# Altium schematic sheet peripherals.SchDoc
size A3; DocumentNumber: 28; SheetNumber: 28; SheetTotal: 45; SheetDescription: MCU Peripherals
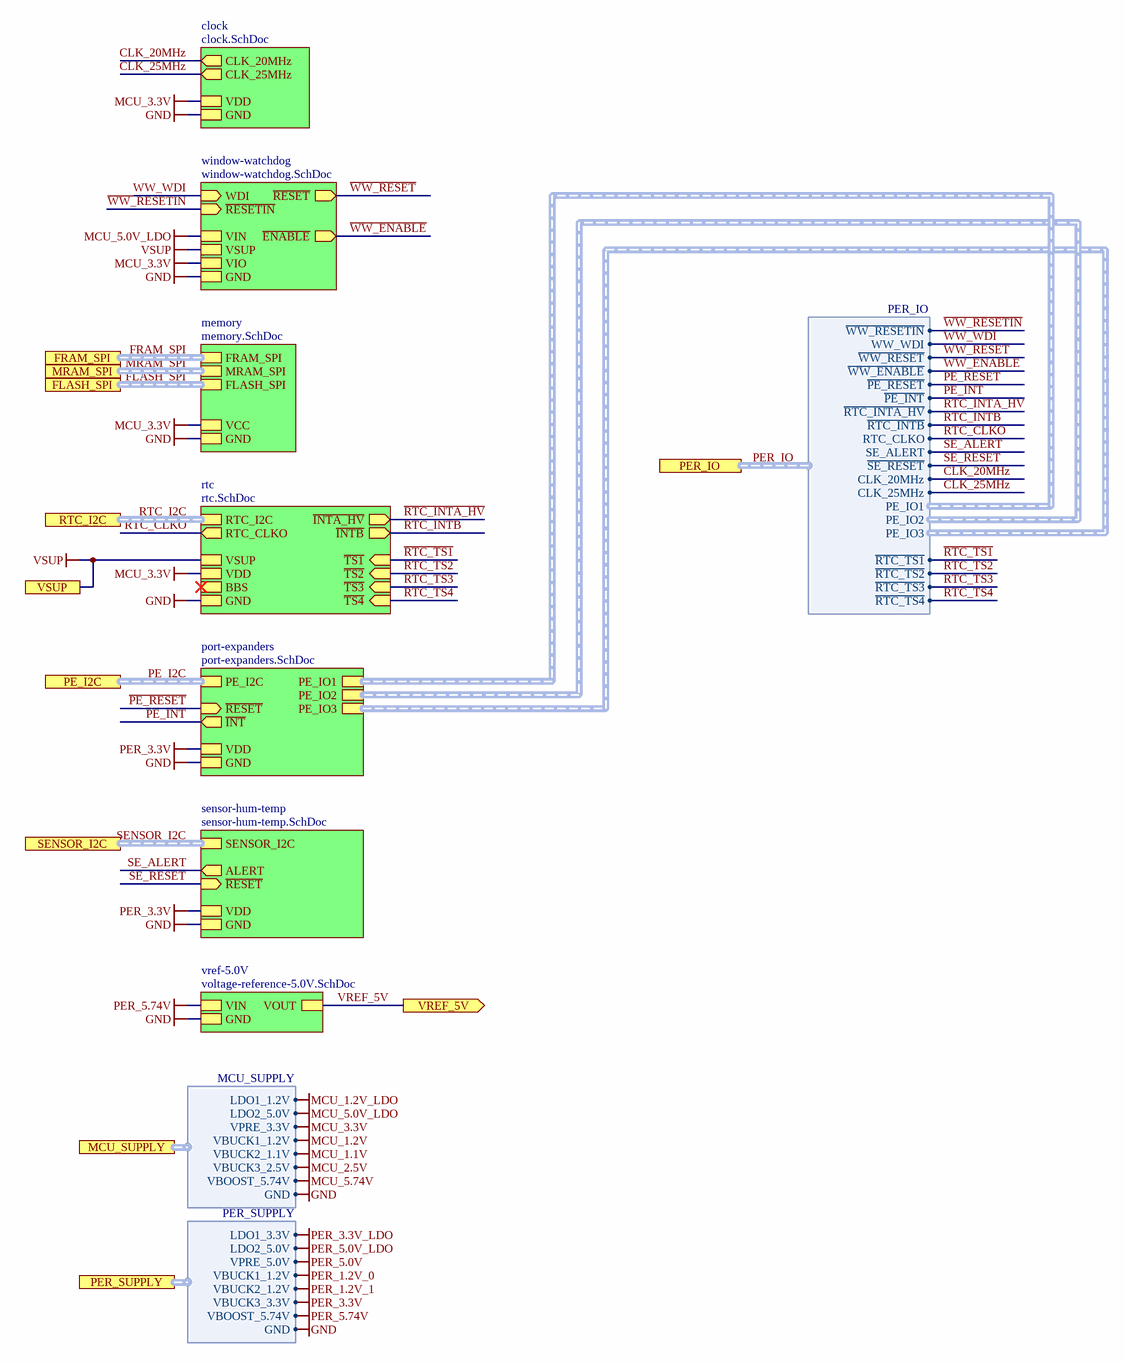
[diagram p0: peripherals.SchDoc]

## Sub-sheets
clock = clock.SchDoc: VDD, GND, CLK_20MHz (out), CLK_25MHz (out)
memory = memory.SchDoc: VCC, GND, FRAM_SPI (harness SPI), MRAM_SPI (harness SPI), FLASH_SPI (harness SPI)
port-expanders = port-expanders.SchDoc: PE_IO2 (harness PE_IO), PE_IO1 (harness PE_IO), GND, VDD, ~{RESET} (in), PE_I2C (harness I2C), ~{INT} (out), PE_IO3 (harness PE_IO)
rtc = rtc.SchDoc: RTC_I2C (harness I2C), ~{INTB} (out), ~{INTA_HV} (out), GND, VSUP, ~{TS4} (in), ~{TS3} (in), ~{TS2} (in), ~{TS1} (in), BBS, RTC_CLKO (out), VDD
sensor-hum-temp = sensor-hum-temp.SchDoc: GND, ~{RESET} (in), ALERT (out), VDD, SENSOR_I2C (harness I2C)
vref-5.0V = voltage-reference-5.0V.SchDoc: GND, VOUT, VIN
window-watchdog = window-watchdog.SchDoc: GND, VIO, ~{ENABLE} (out), ~{RESET} (out), WDI (in), VIN, ~{RESETIN} (in), VSUP

## Ports
FLASH_SPI (harness SPI), FRAM_SPI (harness SPI), MCU_SUPPLY (harness MCU_SUPPLY), MRAM_SPI (harness SPI), PE_I2C (harness I2C), PER_IO (harness PER_IO), PER_SUPPLY (harness PER_SUPPLY), RTC_I2C (harness I2C), SENSOR_I2C (harness I2C), VREF_5V (out), VSUP

## Harnesses
MCU_SUPPLY: VBUCK1_1.2V, VBUCK2_1.1V, VBUCK3_2.5V, LDO1_1.2V, LDO2_5.0V, GND, VPRE_3.3V, VBOOST_5.74V
PER_SUPPLY: GND, VBOOST_5.74V, LDO1_3.3V, LDO2_5.0V, VPRE_5.0V, VBUCK1_1.2V, VBUCK2_1.2V, VBUCK3_3.3V
PER_IO: WW_WDI, ~{WW_RESET}, ~{WW_ENABLE}, ~{PE_RESET}, ~{PE_INT}, ~{RTC_INTA_HV}, ~{RTC_INTB}, RTC_CLKO, SE_ALERT, ~{SE_RESET}, CLK_20MHz, CLK_25MHz, PE_IO1, PE_IO2, PE_IO3, ~{RTC_TS1}, ~{RTC_TS2}, ~{RTC_TS3}, ~{RTC_TS4}, ~{WW_RESETIN}

## Nets
GND: sheet clock/GND, sheet window-watchdog/GND, sheet memory/GND, sheet sensor-hum-temp/GND, sheet rtc/GND, sheet port-expanders/GND, sheet vref-5.0V/GND, port MCU_SUPPLY.GND, port PER_SUPPLY.GND
MCU_1.1V: port MCU_SUPPLY.VBUCK2_1.1V
MCU_1.2V: port MCU_SUPPLY.VBUCK1_1.2V
MCU_1.2V_LDO: port MCU_SUPPLY.LDO1_1.2V
MCU_2.5V: port MCU_SUPPLY.VBUCK3_2.5V
MCU_3.3V: sheet clock/VDD, sheet window-watchdog/VIO, sheet memory/VCC, sheet rtc/VDD, port MCU_SUPPLY.VPRE_3.3V
MCU_5.0V_LDO: sheet window-watchdog/VIN, port MCU_SUPPLY.LDO2_5.0V
MCU_5.74V: port MCU_SUPPLY.VBOOST_5.74V
PER_1.2V_0: port PER_SUPPLY.VBUCK1_1.2V
PER_1.2V_1: port PER_SUPPLY.VBUCK2_1.2V
PER_3.3V: sheet sensor-hum-temp/VDD, sheet port-expanders/VDD, port PER_SUPPLY.VBUCK3_3.3V
PER_3.3V_LDO: port PER_SUPPLY.LDO1_3.3V
PER_5.0V: port PER_SUPPLY.VPRE_5.0V
PER_5.0V_LDO: port PER_SUPPLY.LDO2_5.0V
PER_5.74V: sheet vref-5.0V/VIN, port PER_SUPPLY.VBOOST_5.74V
VSUP: port VSUP, sheet window-watchdog/VSUP, sheet rtc/VSUP
~{PE_INT}: sheet port-expanders/~{INT}, port PER_IO.~{PE_INT}
~{PE_RESET}: sheet port-expanders/~{RESET}, port PER_IO.~{PE_RESET}
~{RTC_INTA_HV}: sheet rtc/~{INTA_HV}, port PER_IO.~{RTC_INTA_HV}
~{RTC_INTB}: sheet rtc/~{INTB}, port PER_IO.~{RTC_INTB}
~{RTC_TS1}: sheet rtc/~{TS1}, port PER_IO.~{RTC_TS1}
~{RTC_TS2}: sheet rtc/~{TS2}, port PER_IO.~{RTC_TS2}
~{RTC_TS3}: sheet rtc/~{TS3}, port PER_IO.~{RTC_TS3}
~{RTC_TS4}: sheet rtc/~{TS4}, port PER_IO.~{RTC_TS4}
~{SE_RESET}: sheet sensor-hum-temp/~{RESET}, port PER_IO.~{SE_RESET}
~{WW_ENABLE}: sheet window-watchdog/~{ENABLE}, port PER_IO.~{WW_ENABLE}
~{WW_RESET}: sheet window-watchdog/~{RESET}, port PER_IO.~{WW_RESET}
~{WW_RESETIN}: sheet window-watchdog/~{RESETIN}, port PER_IO.~{WW_RESETIN}
CLK_20MHz: sheet clock/CLK_20MHz, port PER_IO.CLK_20MHz
CLK_25MHz: sheet clock/CLK_25MHz, port PER_IO.CLK_25MHz
RTC_CLKO: sheet rtc/RTC_CLKO, port PER_IO.RTC_CLKO  [project net PER_IO.RTC_CLKO]
SE_ALERT: sheet sensor-hum-temp/ALERT, port PER_IO.SE_ALERT  [project net PER_IO.SE_ALERT]
VREF_5V: port VREF_5V, sheet vref-5.0V/VOUT
WW_WDI: sheet window-watchdog/WDI, port PER_IO.WW_WDI  [project net PER_IO.WW_WDI]

## Buses and harness runs
harness FLASH_SPI = port FLASH_SPI = sheet memory/FLASH_SPI
harness FRAM_SPI = port FRAM_SPI = sheet memory/FRAM_SPI
harness MRAM_SPI = port MRAM_SPI = sheet memory/MRAM_SPI
harness PE_I2C = port PE_I2C = sheet port-expanders/PE_I2C
harness PER_IO = port PER_IO
harness RTC_I2C = port RTC_I2C = sheet rtc/RTC_I2C
harness SENSOR_I2C = port SENSOR_I2C = sheet sensor-hum-temp/SENSOR_I2C

## Notes on the sheet
- Fraunhofer IISB
- Schottkystr. 10
- developed by:
- 91058 Erlangen
- Germany
- Author
- Project
- License
- Description
- File
- Version
- Release Date
- Sheet
- foxbms.org <https://foxbms.org>
- www.iisb.fraunhofer.de <https://www.iisb.fraunhofer.de/>
- foxBMS Team
- /